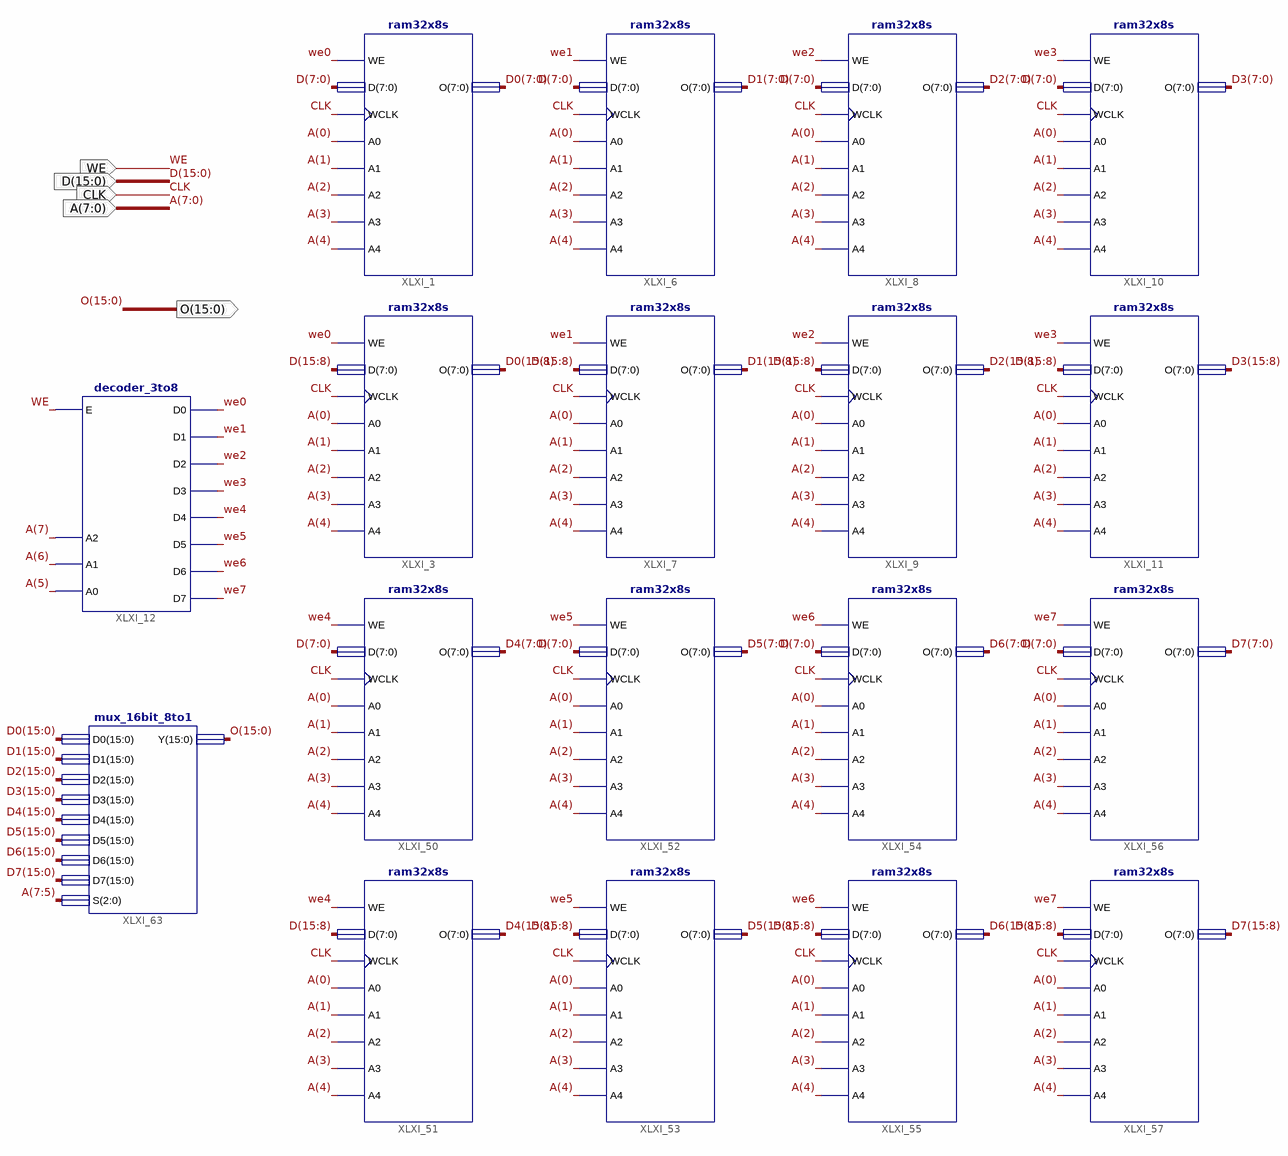
[diagram p0: schematic sheet 1]
// Xilinx ISE schematic RAM_256x16.sch (virtex6) as structural Verilog: 18 symbols, 5 ports
module RAM_256x16 (
  input  CLK,
  input  WE,
  input  [15:0] D,
  input  [7:0] A,
  output [15:0] O
);

  wire we0, we1, we2, we3, we4, we5, we6, we7;
  wire [15:0] D0, D1, D2, D3, D4, D5, D6, D7;

  ram32x8s XLXI_1 (
    .A0(A[0]), .A1(A[1]), .A2(A[2]), .A3(A[3]), .A4(A[4]), .D(D[7:0]), .WCLK(CLK), .WE(we0), .O(D0[7:0]));
  ram32x8s XLXI_3 (
    .A0(A[0]), .A1(A[1]), .A2(A[2]), .A3(A[3]), .A4(A[4]), .D(D[15:8]), .WCLK(CLK), .WE(we0), .O(D0[15:8]));
  ram32x8s XLXI_6 (
    .A0(A[0]), .A1(A[1]), .A2(A[2]), .A3(A[3]), .A4(A[4]), .D(D[7:0]), .WCLK(CLK), .WE(we1), .O(D1[7:0]));
  ram32x8s XLXI_7 (
    .A0(A[0]), .A1(A[1]), .A2(A[2]), .A3(A[3]), .A4(A[4]), .D(D[15:8]), .WCLK(CLK), .WE(we1), .O(D1[15:8]));
  ram32x8s XLXI_8 (
    .A0(A[0]), .A1(A[1]), .A2(A[2]), .A3(A[3]), .A4(A[4]), .D(D[7:0]), .WCLK(CLK), .WE(we2), .O(D2[7:0]));
  ram32x8s XLXI_9 (
    .A0(A[0]), .A1(A[1]), .A2(A[2]), .A3(A[3]), .A4(A[4]), .D(D[15:8]), .WCLK(CLK), .WE(we2), .O(D2[15:8]));
  ram32x8s XLXI_10 (
    .A0(A[0]), .A1(A[1]), .A2(A[2]), .A3(A[3]), .A4(A[4]), .D(D[7:0]), .WCLK(CLK), .WE(we3), .O(D3[7:0]));
  ram32x8s XLXI_11 (
    .A0(A[0]), .A1(A[1]), .A2(A[2]), .A3(A[3]), .A4(A[4]), .D(D[15:8]), .WCLK(CLK), .WE(we3), .O(D3[15:8]));
  ram32x8s XLXI_50 (
    .A0(A[0]), .A1(A[1]), .A2(A[2]), .A3(A[3]), .A4(A[4]), .D(D[7:0]), .WCLK(CLK), .WE(we4), .O(D4[7:0]));
  ram32x8s XLXI_51 (
    .A0(A[0]), .A1(A[1]), .A2(A[2]), .A3(A[3]), .A4(A[4]), .D(D[15:8]), .WCLK(CLK), .WE(we4), .O(D4[15:8]));
  ram32x8s XLXI_52 (
    .A0(A[0]), .A1(A[1]), .A2(A[2]), .A3(A[3]), .A4(A[4]), .D(D[7:0]), .WCLK(CLK), .WE(we5), .O(D5[7:0]));
  ram32x8s XLXI_53 (
    .A0(A[0]), .A1(A[1]), .A2(A[2]), .A3(A[3]), .A4(A[4]), .D(D[15:8]), .WCLK(CLK), .WE(we5), .O(D5[15:8]));
  ram32x8s XLXI_54 (
    .A0(A[0]), .A1(A[1]), .A2(A[2]), .A3(A[3]), .A4(A[4]), .D(D[7:0]), .WCLK(CLK), .WE(we6), .O(D6[7:0]));
  ram32x8s XLXI_55 (
    .A0(A[0]), .A1(A[1]), .A2(A[2]), .A3(A[3]), .A4(A[4]), .D(D[15:8]), .WCLK(CLK), .WE(we6), .O(D6[15:8]));
  ram32x8s XLXI_56 (
    .A0(A[0]), .A1(A[1]), .A2(A[2]), .A3(A[3]), .A4(A[4]), .D(D[7:0]), .WCLK(CLK), .WE(we7), .O(D7[7:0]));
  ram32x8s XLXI_57 (
    .A0(A[0]), .A1(A[1]), .A2(A[2]), .A3(A[3]), .A4(A[4]), .D(D[15:8]), .WCLK(CLK), .WE(we7), .O(D7[15:8]));
  decoder_3to8 XLXI_12 (
    .D0(we0), .D1(we1), .D2(we2), .D3(we3), .D4(we4), .D5(we5), .D6(we6), .D7(we7), .A0(A[5]), .A1(A[6]),
    .A2(A[7]), .E(WE));
  mux_16bit_8to1 XLXI_63 (.S(A[7:5]), .D7(D7), .D6(D6), .D5(D5), .D4(D4), .D3(D3), .D2(D2), .D1(D1), .D0(D0), .Y(O));
endmodule
